# EAGLE design CanBus-Gartensteuerung (EAGLE 7.4.0)

## Sheet 1 of 3
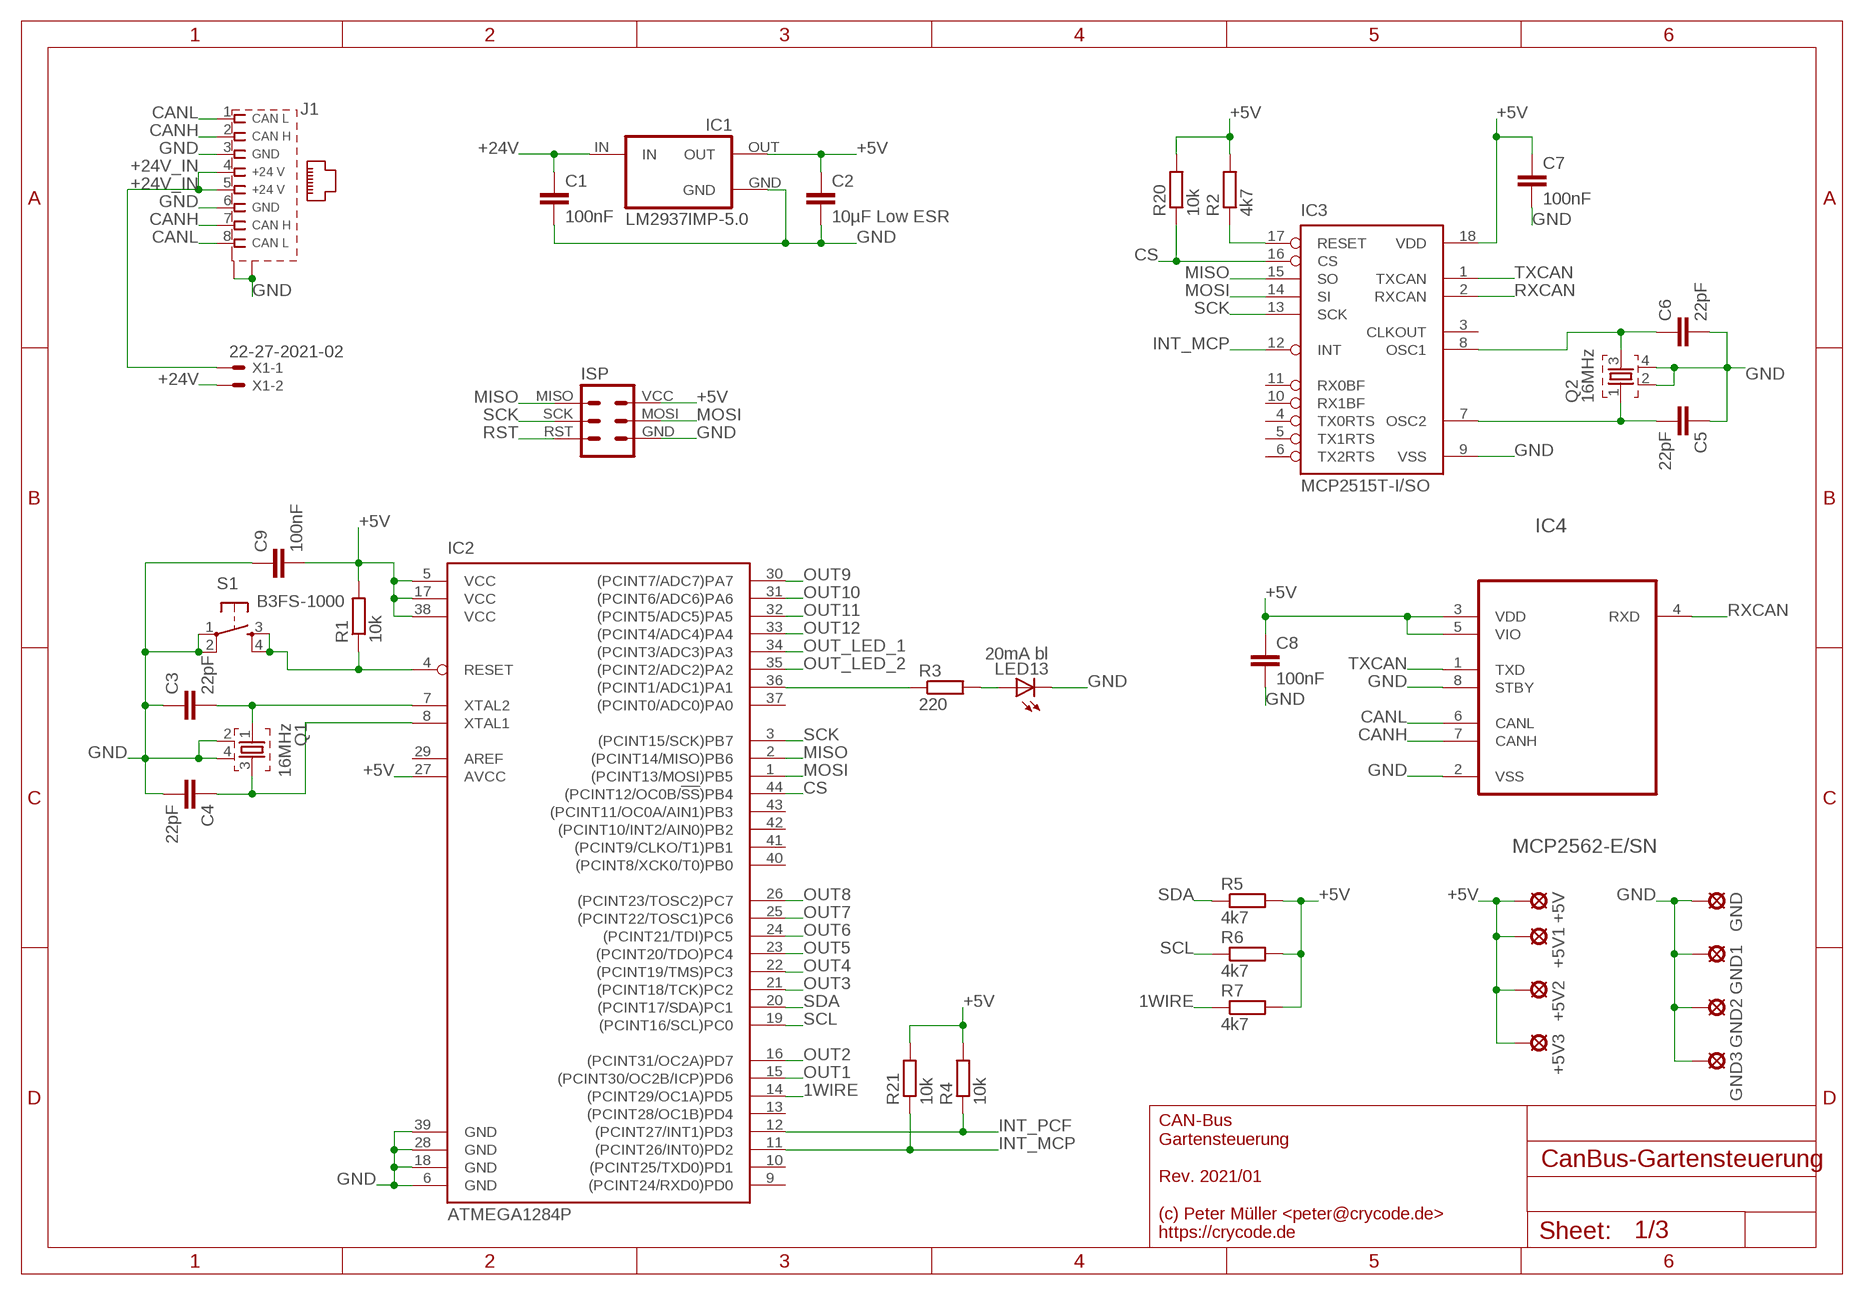
[diagram p0: schematic, sheet 1]

### Parts
+5V  LSP13  [LSP13]
+5V1  LSP13  [LSP13]
+5V2  LSP13  [LSP13]
+5V3  LSP13  [LSP13]
C1  100nF  C-EUC0805  [C0805]
C2  10µF Low ESR  C-EUC0805  [C0805]
C3  22pF  C-EUC0805  [C0805]
C4  22pF  C-EUC0805  [C0805]
C5  22pF  C-EUC0805  [C0805]
C6  22pF  C-EUC0805  [C0805]
C7  100nF  C-EUC0805  [C0805]
C8  100nF  C-EUC0805  [C0805]
C9  100nF  C-EUC0805  [C0805]
GND  LSP13  [LSP13]
GND1  LSP13  [LSP13]
GND2  LSP13  [LSP13]
GND3  LSP13  [LSP13]
IC1  LM2937IMP-5.0  [SOT223]
IC2  ATMEGA1284P  ATMEGA644A  [TQFP44]
IC3  MCP2515T-I/SO  [SO18L]
IC4  MCP2562-E/SN  [SO08]
ISP  ISPVIAS-ONLY-1.27MM  [ISP-VIAS-ONLY-1.27MM]
J1  RJ45-CAN  [MEBP_8-8G]
LED13  20mA bl  LEDCHIPLED_0805  [CHIPLED_0805]
Q1  16MHz  EUROQUARTZ-MMJ  [MJ-5X3.2]
Q2  16MHz  EUROQUARTZ-MMJ  [MJ-5X3.2]
R1  10k  R-EU_R0805  [R0805]
R2  4k7  R-EU_R0805  [R0805]
R3  220  R-EU_R0805  [R0805]
R4  10k  R-EU_R0805  [R0805]
R5  4k7  R-EU_R0805  [R0805]
R6  4k7  R-EU_R0805  [R0805]
R7  4k7  R-EU_R0805  [R0805]
R20  10k  R-EU_R0805  [R0805]
R21  10k  R-EU_R0805  [R0805]
S1  B3FS-1000  [B3FS-1000]
X1  22-27-2021-02  [6410-02]

### Nets
1WIRE: IC2.14((PCINT29/OC1A)PD5) R7.1 ; also sheet 2
+5V: +5V1.MP +5V2.MP +5V3.MP +5V.MP C2.1 C7.1 C8.1 C9.2 IC1.OUT IC2.5(VCC) IC2.17(VCC) IC2.27(AVCC) IC2.38(VCC) IC3.18(VDD) IC4.3(VDD) IC4.5(VIO) ISP.VCC R1.2 R2.2 R4.2 R5.2 R6.2 R7.2 R20.2 R21.2 ; also sheet 2
+24V: C1.1 IC1.IN X1.2 ; also sheet 3
+24V_IN: J1.4 J1.5 X1.1
CANH: IC4.7(CANH) J1.2 J1.7
CANL: IC4.6(CANL) J1.1 J1.8
CS: IC2.44((PCINT12/OC0B/!SS!)PB4) IC3.16(CS) R20.1
GND: C1.2 C2.2 C3.1 C4.2 C5.1 C6.2 C7.2 C8.2 C9.1 GND1.MP GND2.MP GND3.MP GND.MP IC1.GND IC2.6(GND) IC2.18(GND) IC2.28(GND) IC2.39(GND) IC3.9(VSS) IC4.2(VSS) IC4.8(STBY) ISP.GND J1.3 J1.6 J1.G1(S1) J1.G2(S2) LED13.C Q1.2 Q1.4 Q2.2 Q2.4 S1.1(P) S1.2(P1) ; also sheet 2,3
INT_MCP: IC2.11((PCINT26/INT0)PD2) IC3.12(INT) R21.1
INT_PCF: IC2.12((PCINT27/INT1)PD3) R4.1 ; also sheet 2
MISO: IC2.2((PCINT14/MISO)PB6) IC3.15(SO) ISP.MISO
MOSI: IC2.1((PCINT13/MOSI)PB5) IC3.14(SI) ISP.MOSI
N$1: IC3.17(RESET) R2.1
N$2: IC2.36((PCINT1/ADC1)PA1) R3.1
N$10: LED13.A R3.2
OUT1: IC2.15((PCINT30/OC2B/ICP)PD6) ; also sheet 2,3
OUT2: IC2.16((PCINT31/OC2A)PD7) ; also sheet 2,3
OUT3: IC2.21((PCINT18/TCK)PC2) ; also sheet 2,3
OUT4: IC2.22((PCINT19/TMS)PC3) ; also sheet 2,3
OUT5: IC2.23((PCINT20/TDO)PC4) ; also sheet 2,3
OUT6: IC2.24((PCINT21/TDI)PC5) ; also sheet 2,3
OUT7: IC2.25((PCINT22/TOSC1)PC6) ; also sheet 2,3
OUT8: IC2.26((PCINT23/TOSC2)PC7) ; also sheet 2,3
OUT9: IC2.30((PCINT7/ADC7)PA7) ; also sheet 2,3
OUT10: IC2.31((PCINT6/ADC6)PA6) ; also sheet 2,3
OUT11: IC2.32((PCINT5/ADC5)PA5) ; also sheet 2,3
OUT12: IC2.33((PCINT4/ADC4)PA4) ; also sheet 2,3
OUT_LED_1: IC2.34((PCINT3/ADC3)PA3) ; also sheet 3
OUT_LED_2: IC2.35((PCINT2/ADC2)PA2) ; also sheet 3
RST: IC2.4(RESET) ISP.RST R1.1 S1.3(S) S1.4(S1)
RXCAN: IC3.2(RXCAN) IC4.4(RXD)
SCK: IC2.3((PCINT15/SCK)PB7) IC3.13(SCK) ISP.SCK
SCL: IC2.19((PCINT16/SCL)PC0) R6.1 ; also sheet 2
SDA: IC2.20((PCINT17/SDA)PC1) R5.1 ; also sheet 2
TXCAN: IC3.1(TXCAN) IC4.1(TXD)
XTAL1: C3.2 IC2.7(XTAL2) Q1.1
XTAL2: C4.1 IC2.8(XTAL1) Q1.3
XTAL3: C5.2 IC3.7(OSC2) Q2.1
XTAL4: C6.1 IC3.8(OSC1) Q2.3
Unconnected: IC2.9((PCINT24/RXD0)PD0) IC2.10((PCINT25/TXD0)PD1) IC2.13((PCINT28/OC1B)PD4) IC2.29(AREF) IC2.37((PCINT0/ADC0)PA0) IC2.40((PCINT8/XCK0/T0)PB0) IC2.41((PCINT9/CLKO/T1)PB1) IC2.42((PCINT10/INT2/AIN0)PB2) IC2.43((PCINT11/OC0A/AIN1)PB3) IC3.3(CLKOUT) IC3.4(TX0RTS) IC3.5(TX1RTS) IC3.6(TX2RTS) IC3.10(RX1BF) IC3.11(RX0BF)

### Notes on the sheet
- CAN-Bus
  Gartensteuerung
  
  Rev. 2021/01
  
  (c) Peter Müller <peter@crycode.de>
  https://crycode.de

## Sheet 2 of 3
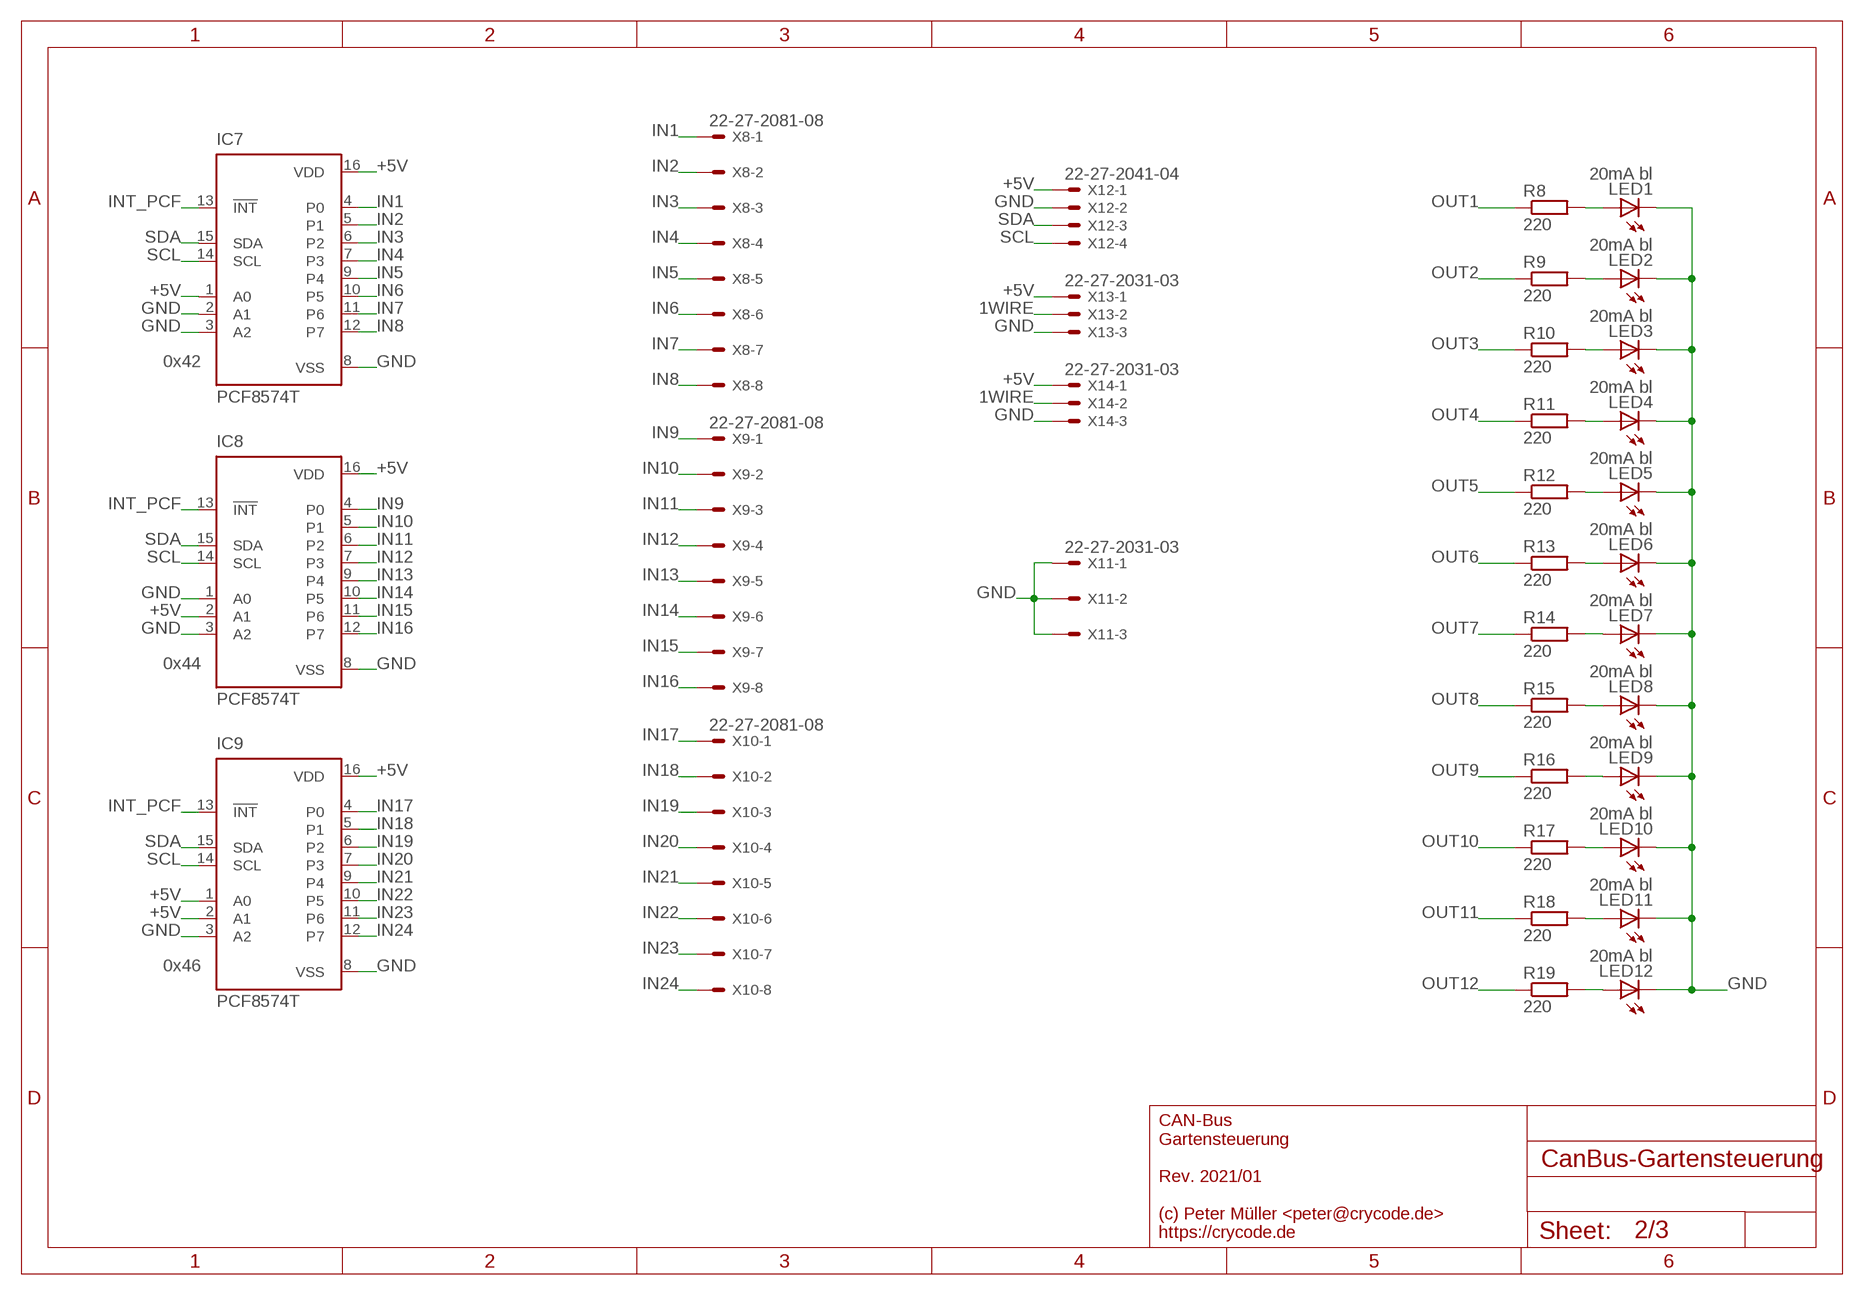
[diagram p1: schematic, sheet 2]

### Parts
IC7  PCF8574T  [SO16W]
IC8  PCF8574T  [SO16W]
IC9  PCF8574T  [SO16W]
LED1  20mA bl  LEDCHIPLED_0805  [CHIPLED_0805]
LED2  20mA bl  LEDCHIPLED_0805  [CHIPLED_0805]
LED3  20mA bl  LEDCHIPLED_0805  [CHIPLED_0805]
LED4  20mA bl  LEDCHIPLED_0805  [CHIPLED_0805]
LED5  20mA bl  LEDCHIPLED_0805  [CHIPLED_0805]
LED6  20mA bl  LEDCHIPLED_0805  [CHIPLED_0805]
LED7  20mA bl  LEDCHIPLED_0805  [CHIPLED_0805]
LED8  20mA bl  LEDCHIPLED_0805  [CHIPLED_0805]
LED9  20mA bl  LEDCHIPLED_0805  [CHIPLED_0805]
LED10  20mA bl  LEDCHIPLED_0805  [CHIPLED_0805]
LED11  20mA bl  LEDCHIPLED_0805  [CHIPLED_0805]
LED12  20mA bl  LEDCHIPLED_0805  [CHIPLED_0805]
R8  220  R-EU_R0805  [R0805]
R9  220  R-EU_R0805  [R0805]
R10  220  R-EU_R0805  [R0805]
R11  220  R-EU_R0805  [R0805]
R12  220  R-EU_R0805  [R0805]
R13  220  R-EU_R0805  [R0805]
R14  220  R-EU_R0805  [R0805]
R15  220  R-EU_R0805  [R0805]
R16  220  R-EU_R0805  [R0805]
R17  220  R-EU_R0805  [R0805]
R18  220  R-EU_R0805  [R0805]
R19  220  R-EU_R0805  [R0805]
X8  22-27-2081-08  [6410-08]
X9  22-27-2081-08  [6410-08]
X10  22-27-2081-08  [6410-08]
X11  22-27-2031-03  [6410-03]
X12  22-27-2041-04  [6410-04]
X13  22-27-2031-03  [6410-03]
X14  22-27-2031-03  [6410-03]

### Nets
1WIRE: X13.2 X14.2 ; also sheet 1
+5V: IC7.1(A0) IC7.16(VDD) IC8.2(A1) IC8.16(VDD) IC9.1(A0) IC9.2(A1) IC9.16(VDD) X12.1 X13.1 X14.1 ; also sheet 1
GND: IC7.2(A1) IC7.3(A2) IC7.8(VSS) IC8.1(A0) IC8.3(A2) IC8.8(VSS) IC9.3(A2) IC9.8(VSS) LED1.C LED2.C LED3.C LED4.C LED5.C LED6.C LED7.C LED8.C LED9.C LED10.C LED11.C LED12.C X11.1 X11.2 X11.3 X12.2 X13.3 X14.3 ; also sheet 1,3
IN1: IC7.4(P0) X8.1
IN2: IC7.5(P1) X8.2
IN3: IC7.6(P2) X8.3
IN4: IC7.7(P3) X8.4
IN5: IC7.9(P4) X8.5
IN6: IC7.10(P5) X8.6
IN7: IC7.11(P6) X8.7
IN8: IC7.12(P7) X8.8
IN9: IC8.4(P0) X9.1
IN10: IC8.5(P1) X9.2
IN11: IC8.6(P2) X9.3
IN12: IC8.7(P3) X9.4
IN13: IC8.9(P4) X9.5
IN14: IC8.10(P5) X9.6
IN15: IC8.11(P6) X9.7
IN16: IC8.12(P7) X9.8
IN17: IC9.4(P0) X10.1
IN18: IC9.5(P1) X10.2
IN19: IC9.6(P2) X10.3
IN20: IC9.7(P3) X10.4
IN21: IC9.9(P4) X10.5
IN22: IC9.10(P5) X10.6
IN23: IC9.11(P6) X10.7
IN24: IC9.12(P7) X10.8
INT_PCF: IC7.13(!INT) IC8.13(!INT) IC9.13(!INT) ; also sheet 1
N$22: LED1.A R8.2
N$23: LED2.A R9.2
N$24: LED3.A R10.2
N$25: LED4.A R11.2
N$32: LED5.A R12.2
N$33: LED6.A R13.2
N$34: LED7.A R14.2
N$35: LED8.A R15.2
N$36: LED9.A R16.2
N$37: LED10.A R17.2
N$38: LED12.A R19.2
N$39: LED11.A R18.2
OUT1: R8.1 ; also sheet 1,3
OUT2: R9.1 ; also sheet 1,3
OUT3: R10.1 ; also sheet 1,3
OUT4: R11.1 ; also sheet 1,3
OUT5: R12.1 ; also sheet 1,3
OUT6: R13.1 ; also sheet 1,3
OUT7: R14.1 ; also sheet 1,3
OUT8: R15.1 ; also sheet 1,3
OUT9: R16.1 ; also sheet 1,3
OUT10: R17.1 ; also sheet 1,3
OUT11: R18.1 ; also sheet 1,3
OUT12: R19.1 ; also sheet 1,3
SCL: IC7.14(SCL) IC8.14(SCL) IC9.14(SCL) X12.4 ; also sheet 1
SDA: IC7.15(SDA) IC8.15(SDA) IC9.15(SDA) X12.3 ; also sheet 1

### Notes on the sheet
- 0x42
- 0x44
- 0x46
- CAN-Bus
  Gartensteuerung
  
  Rev. 2021/01
  
  (c) Peter Müller <peter@crycode.de>
  https://crycode.de

## Sheet 3 of 3
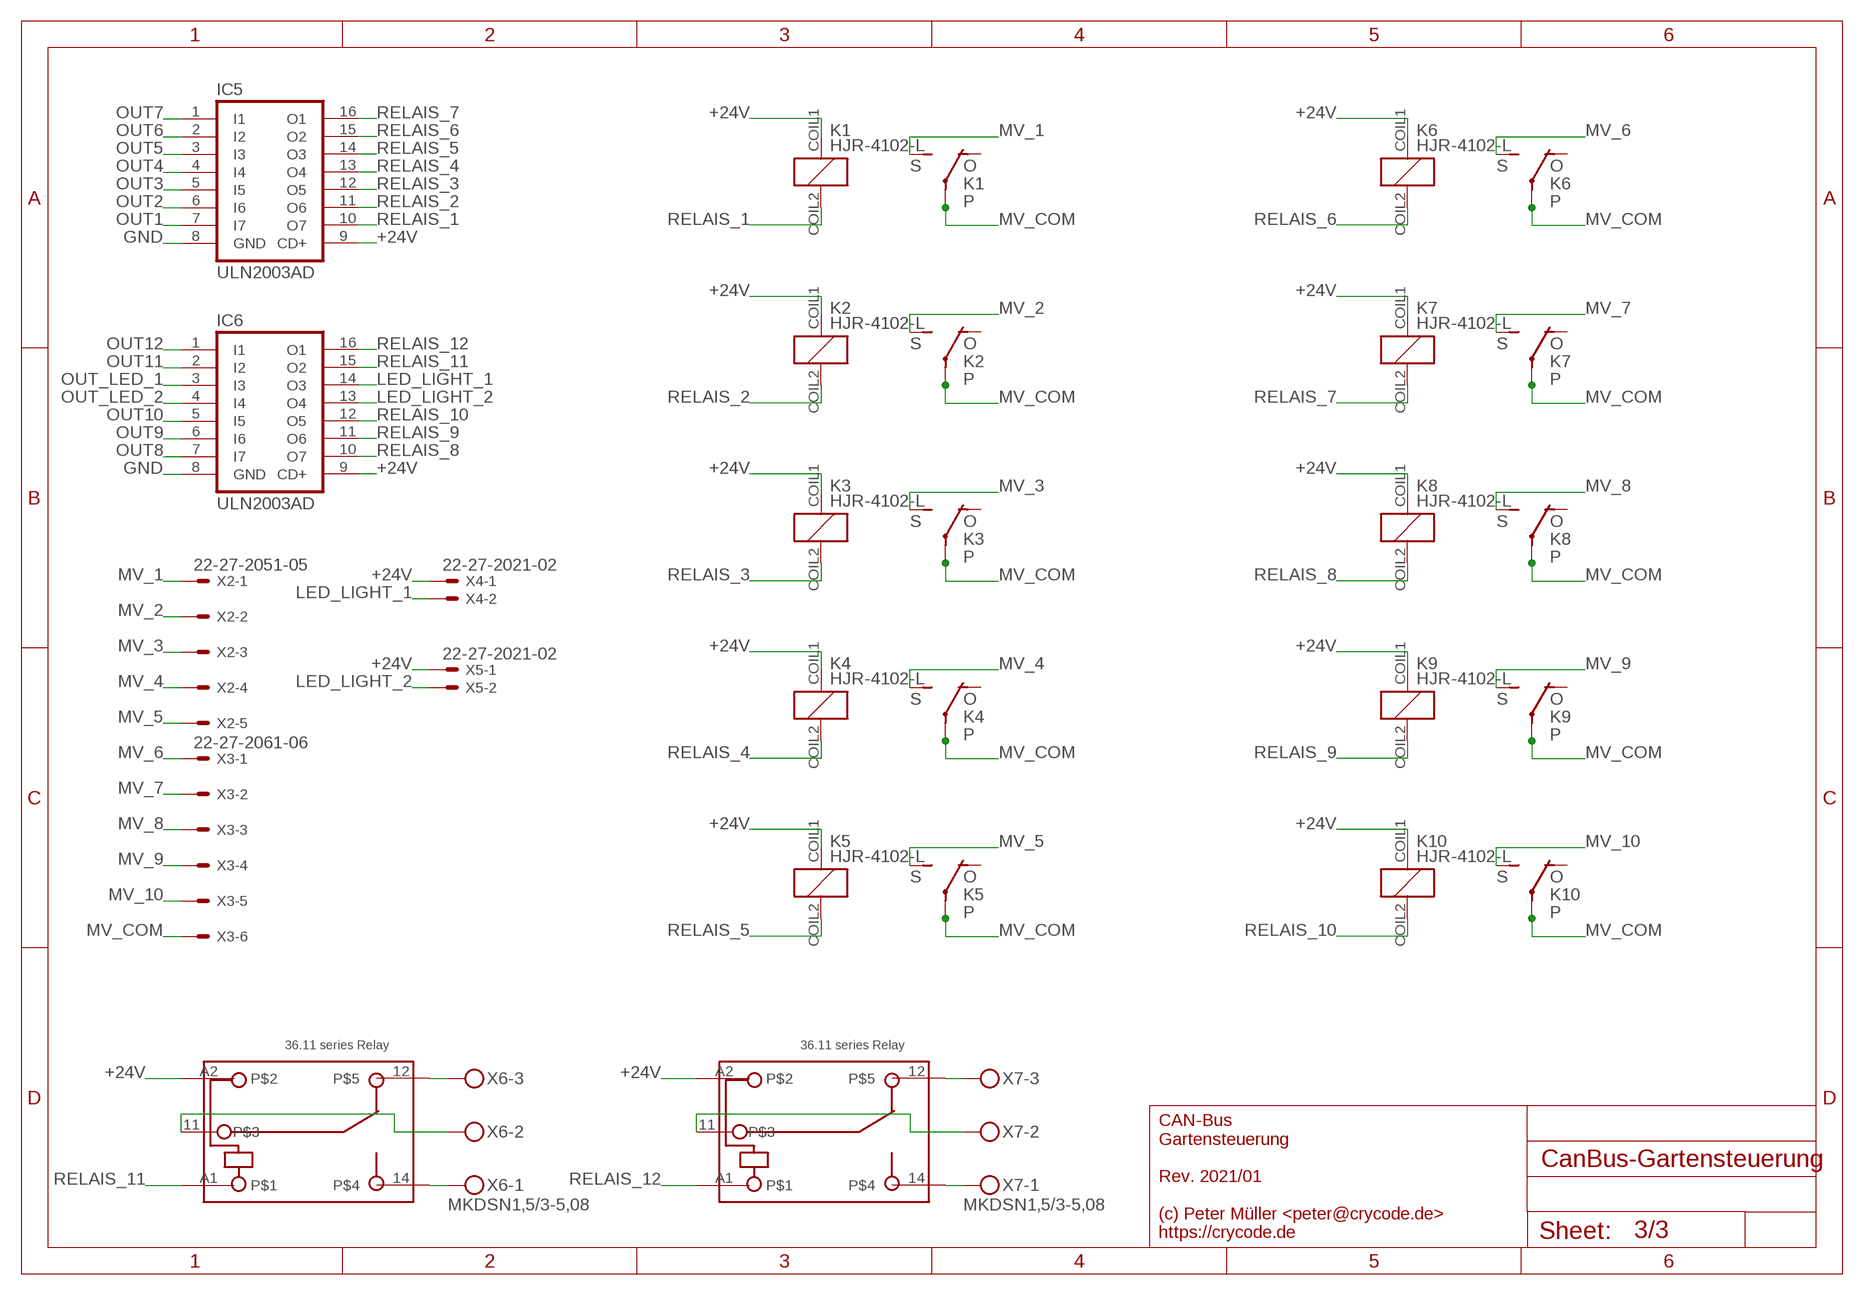
[diagram p2: schematic, sheet 3]

### Parts
IC5  ULN2003AD  [SO16]
IC6  ULN2003AD  [SO16]
K1  HJR-4102-L  [HJR4102]
K2  HJR-4102-L  [HJR4102]
K3  HJR-4102-L  [HJR4102]
K4  HJR-4102-L  [HJR4102]
K5  HJR-4102-L  [HJR4102]
K6  HJR-4102-L  [HJR4102]
K7  HJR-4102-L  [HJR4102]
K8  HJR-4102-L  [HJR4102]
K9  HJR-4102-L  [HJR4102]
K10  HJR-4102-L  [HJR4102]
K11  36.11  [36.11]
K12  36.11  [36.11]
X2  22-27-2051-05  [6410-05]
X3  22-27-2061-06  [6410-06]
X4  22-27-2021-02  [6410-02]
X5  22-27-2021-02  [6410-02]
X6  MKDSN1,5/3-5,08  [MKDSN1,5/3-5,08]
X7  MKDSN1,5/3-5,08  [MKDSN1,5/3-5,08]

### Nets
+24V: IC5.9(CD+) IC6.9(CD+) K1.COIL1 K2.COIL1 K3.COIL1 K4.COIL1 K5.COIL1 K6.COIL1 K7.COIL1 K8.COIL1 K9.COIL1 K10.COIL1 K11.A2 K12.A2 X4.1 X5.1 ; also sheet 1
GND: IC5.8(GND) IC6.8(GND) ; also sheet 1,2
LED_LIGHT_1: IC6.14(O3) X4.2
LED_LIGHT_2: IC6.13(O4) X5.2
MV_1: K1.CON1DEFAULT(S) X2.1
MV_2: K2.CON1DEFAULT(S) X2.2
MV_3: K3.CON1DEFAULT(S) X2.3
MV_4: K4.CON1DEFAULT(S) X2.4
MV_5: K5.CON1DEFAULT(S) X2.5
MV_6: K6.CON1DEFAULT(S) X3.1
MV_7: K7.CON1DEFAULT(S) X3.2
MV_8: K8.CON1DEFAULT(S) X3.3
MV_9: K9.CON1DEFAULT(S) X3.4
MV_10: K10.CON1DEFAULT(S) X3.5
MV_COM: K1.CENTER1(P) K1.CENTER2(P2) K2.CENTER1(P) K2.CENTER2(P2) K3.CENTER1(P) K3.CENTER2(P2) K4.CENTER1(P) K4.CENTER2(P2) K5.CENTER1(P) K5.CENTER2(P2) K6.CENTER1(P) K6.CENTER2(P2) K7.CENTER1(P) K7.CENTER2(P2) K8.CENTER1(P) K8.CENTER2(P2) K9.CENTER1(P) K9.CENTER2(P2) K10.CENTER1(P) K10.CENTER2(P2) X3.6
N$11: K11.12 X6.3
N$12: K11.14 X6.1
N$13: K12.12 X7.3
N$14: K12.14 X7.1
N$17: K11.11 X6.2
N$18: K12.11 X7.2
OUT1: IC5.7(I7) ; also sheet 1,2
OUT2: IC5.6(I6) ; also sheet 1,2
OUT3: IC5.5(I5) ; also sheet 1,2
OUT4: IC5.4(I4) ; also sheet 1,2
OUT5: IC5.3(I3) ; also sheet 1,2
OUT6: IC5.2(I2) ; also sheet 1,2
OUT7: IC5.1(I1) ; also sheet 1,2
OUT8: IC6.7(I7) ; also sheet 1,2
OUT9: IC6.6(I6) ; also sheet 1,2
OUT10: IC6.5(I5) ; also sheet 1,2
OUT11: IC6.2(I2) ; also sheet 1,2
OUT12: IC6.1(I1) ; also sheet 1,2
OUT_LED_1: IC6.3(I3) ; also sheet 1
OUT_LED_2: IC6.4(I4) ; also sheet 1
RELAIS_1: IC5.10(O7) K1.COIL2
RELAIS_2: IC5.11(O6) K2.COIL2
RELAIS_3: IC5.12(O5) K3.COIL2
RELAIS_4: IC5.13(O4) K4.COIL2
RELAIS_5: IC5.14(O3) K5.COIL2
RELAIS_6: IC5.15(O2) K6.COIL2
RELAIS_7: IC5.16(O1) K7.COIL2
RELAIS_8: IC6.10(O7) K8.COIL2
RELAIS_9: IC6.11(O6) K9.COIL2
RELAIS_10: IC6.12(O5) K10.COIL2
RELAIS_11: IC6.15(O2) K11.A1
RELAIS_12: IC6.16(O1) K12.A1
Unconnected: K1.CON2OPTION(O) K2.CON2OPTION(O) K3.CON2OPTION(O) K4.CON2OPTION(O) K5.CON2OPTION(O) K6.CON2OPTION(O) K7.CON2OPTION(O) K8.CON2OPTION(O) K9.CON2OPTION(O) K10.CON2OPTION(O)

### Notes on the sheet
- CAN-Bus
  Gartensteuerung
  
  Rev. 2021/01
  
  (c) Peter Müller <peter@crycode.de>
  https://crycode.de

## Power pins joined to a net without a drawn wire
GND: IC1.GND@(GND)

## Library data of the parts
+5V +5V1-+5V3 GND GND1-GND3 = solpad:LSP13: SOLDER PAD drill 1.3 mm, distributor Buerklin, 12H562
C1-C9 = rcl:C-EU: CAPACITOR, European symbol
IC1 = lm2937:LM2937IMP-*: 400 and 500 mA Low Dropout Voltage Regulator NATIONAL SEMICONDUCTOR created by Peter.Hofmann@ph-tronic.de <mailto:Reter.Hofmann@ph-tronic.de> 10-2004 Rev.0
IC2 = atmel:ATMEGA644: 8-bit Microcontroller with 64K Bytes In-System Programmable Flash Source: http://www.atmel.com/dyn/resources/prod_documents/doc2593.pdf; MPN: ATMEGA644PV-10AU; OC_FARNELL: 1455123; OC_NEWARK: 58M3748
IC3 = mcp2515_2551_2562:MCP2515
IC4 = mcp2515_2551_2562:MCP2562: High-Speed CAN Transceiver,DIP-8
IC5 IC6 = uln-udn:ULN2003A: DRIVER ARRAY
IC7-IC9 = micro-philips:PCF8574: I2C-Bus Remote 8-bit I/O expander http://www.semiconductors.philips.com/acrobat_download/datasheets/PCF8574_4.pdf; MPN: PCF8574T/3,512; OC_FARNELL: 1201255; OC_NEWARK: 70R6870
ISP = pogo-isp:ISP: ISP connector pads for Pogo ISP There are variants for mixed pads/vias, pads only and vias.
J1 = can-bus:RJ45-CAN: RJ45 CAN-Bus Reichelt Bestell-Nr.: MEBP 8-8G
K1-K10 = relay:HJR-4102-L
K11 K12 = relay_finder_36_11:36.11: Printed circuit mount miniature 10 A relay one pole changeover contacts Conform RoHS
LED1-LED13 = led:LED: LED OSRAM: - CHIPLED LG R971, LG N971, LY N971, LG Q971, LY Q971, LO R971, LY R971 LH N974, LH R974 LS Q976, LO Q976, LY Q976 LO Q996 - Hyper CHIPLED LW Q18S LB Q993, LB Q99A, LB R99A - SideLED LS A670, LO A670, LY A670, LG A670, LP A670 LB A673, LV A673, LT A673, LW A673 LH A674 LY A675 LS A676, LA A676, LO A676, LY A676, LW A676 LS A679, LY A679, LG A679 - Hyper Micro SIDELED® LS Y876, LA Y876, LO Y876, LY Y876 LT Y87S - SmartLED LW L88C, LW L88S LB L89C, LB L89S, LG L890 LS L89K, LO L89K, LY L89K LS L896, LA L896, LO L896, LY L896 - TOPLED LS T670, LO T670, LY T670, LG T670, LP T670 LSG T670, LSP T670, LSY T670, LOP T670, LYG T670 LG T671, LOG T671, LSG T671 LB T673, LV T673, LT T673, LW T673 LH T674 LS T676, LA T676, LO T676, LY T676, LB T676, LH T676, LSB T676, LW T676 LB T67C, LV T67C, LT T67C, LS T67K, LO T67K, LY T67K, LW E67C LS E67B, LA E67B, LO E67B, LY E67B, LB E67C, LV E67C, LT E67C LW T67C LS T679, LY T679, LG T679 LS T770, LO T770, LY T770, LG T770, LP T770 LB T773, LV T773, LT T773, LW T773 LH T774 LS E675, LA E675, LY E675, LS T675 LS T776, LA T776, LO T776, LY T776, LB T776 LHGB T686 LT T68C, LB T68C - Hyper Mini TOPLED® LB M676 - Mini TOPLED Santana® LG M470 LS M47K, LO M47K, LY M47K Source: http://www.osram.convergy.de LUXEON: - LUMILED® LXK2-PW12-R00, LXK2-PW12-S00, LXK2-PW14-U00, LXK2-PW14-V00 LXK2-PM12-R00, LXK2-PM12-S00, LXK2-PM14-U00 LXK2-PE12-Q00, LXK2-PE12-R00, LXK2-PE12-S00, LXK2-PE14-T00, LXK2-PE14-U00 LXK2-PB12-K00, LXK2-PB12-L00, LXK2-PB12-M00, LXK2-PB14-N00, LXK2-PB14-P00, LXK2-PB14-Q00 LXK2-PR12-L00, LXK2-PR12-M00, LXK2-PR14-Q00, LXK2-PR14-R00 LXK2-PD12-Q00, LXK2-PD12-R00, LXK2-PD12-S00 LXK2-PH12-R00, LXK2-PH12-S00 LXK2-PL12-P00, LXK2-PL12-Q00, LXK2-PL12-R00 Source: www.luxeon.com KINGBRIGHT: KA-3528ASYC Source: www.kingbright.com
Q1 Q2 = crystal-smd:EUROQUARTZ-M*: Keramik-SMD-Quarz, 5x7x1,2mm EUROQUARTZ MQ2 Crystal, 4 pad Soruce: MQ <https://cdn-reichelt.de/documents/datenblatt/B400/MQ.pdf>, MJ <https://cdn-reichelt.de/documents/datenblatt/B400/MJ.pdf>; REICHELT: 16,000000-MJ
R1-R21 = rcl:R-EU_: RESISTOR, European symbol
S1 = b3fs-1000:B3FS-1000
X1 X4 X5 = con-molex:22-?-02: CONNECTOR wire to board 2.54 mm (.1 inch) pitch header; OC_FARNELL: unknown; OC_NEWARK: unknown
X2 = con-molex:22-?-05: CONNECTOR wire to board 2.54 mm (.1 inch) pitch header; OC_FARNELL: unknown; OC_NEWARK: unknown
X3 = con-molex:22-?-06: CONNECTOR wire to board 2.54 mm (.1 inch) pitch header; OC_FARNELL: unknown; OC_NEWARK: unknown
X6 X7 = con-phoenix-508:MKDSN1,5/3-5,08: MKDSN 1,5/ 3-5,08 Printklemme Nennstrom: 13,5 A Nennspannung: 250 V Rastermaß: 5,08 mm Polzahl: 3 Anschlussart: Schraubanschluss Montage: Löten Anschlussrichtung Leiter/Platine: 0 ° Artikelnummer: 1729131 Source: http://eshop.phoenixcontact.com .. 1729131.pdf
X8-X10 = con-molex:22-?-08: CONNECTOR wire to board 2.54 mm (.1 inch) pitch header; OC_FARNELL: unknown; OC_NEWARK: unknown
X11 X13 X14 = con-molex:22-?-03: CONNECTOR wire to board 2.54 mm (.1 inch) pitch header; OC_FARNELL: unknown; OC_NEWARK: unknown
X12 = con-molex:22-?-04: CONNECTOR wire to board 2.54 mm (.1 inch) pitch header; OC_FARNELL: unknown; OC_NEWARK: unknown

## Net classes
1 230V: width 2.54 mm, clearance 2.54 mm

## Board
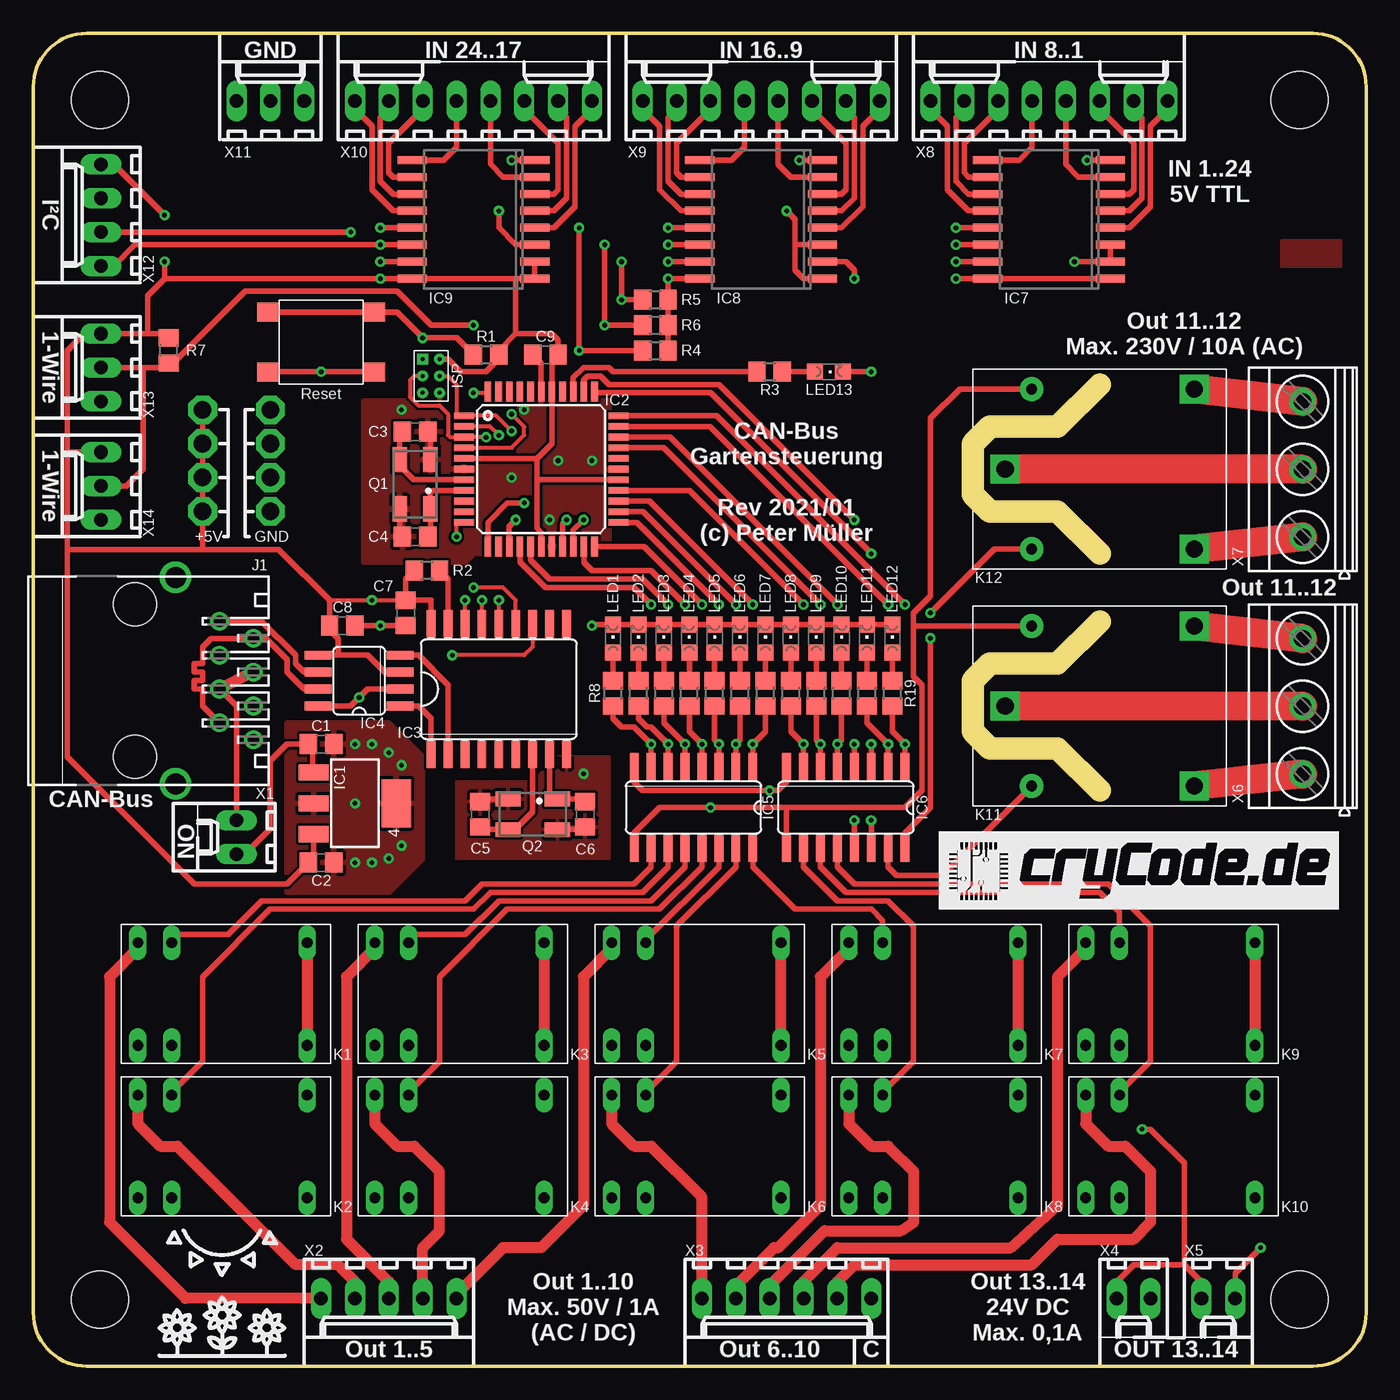
[diagram p3: board, top side]
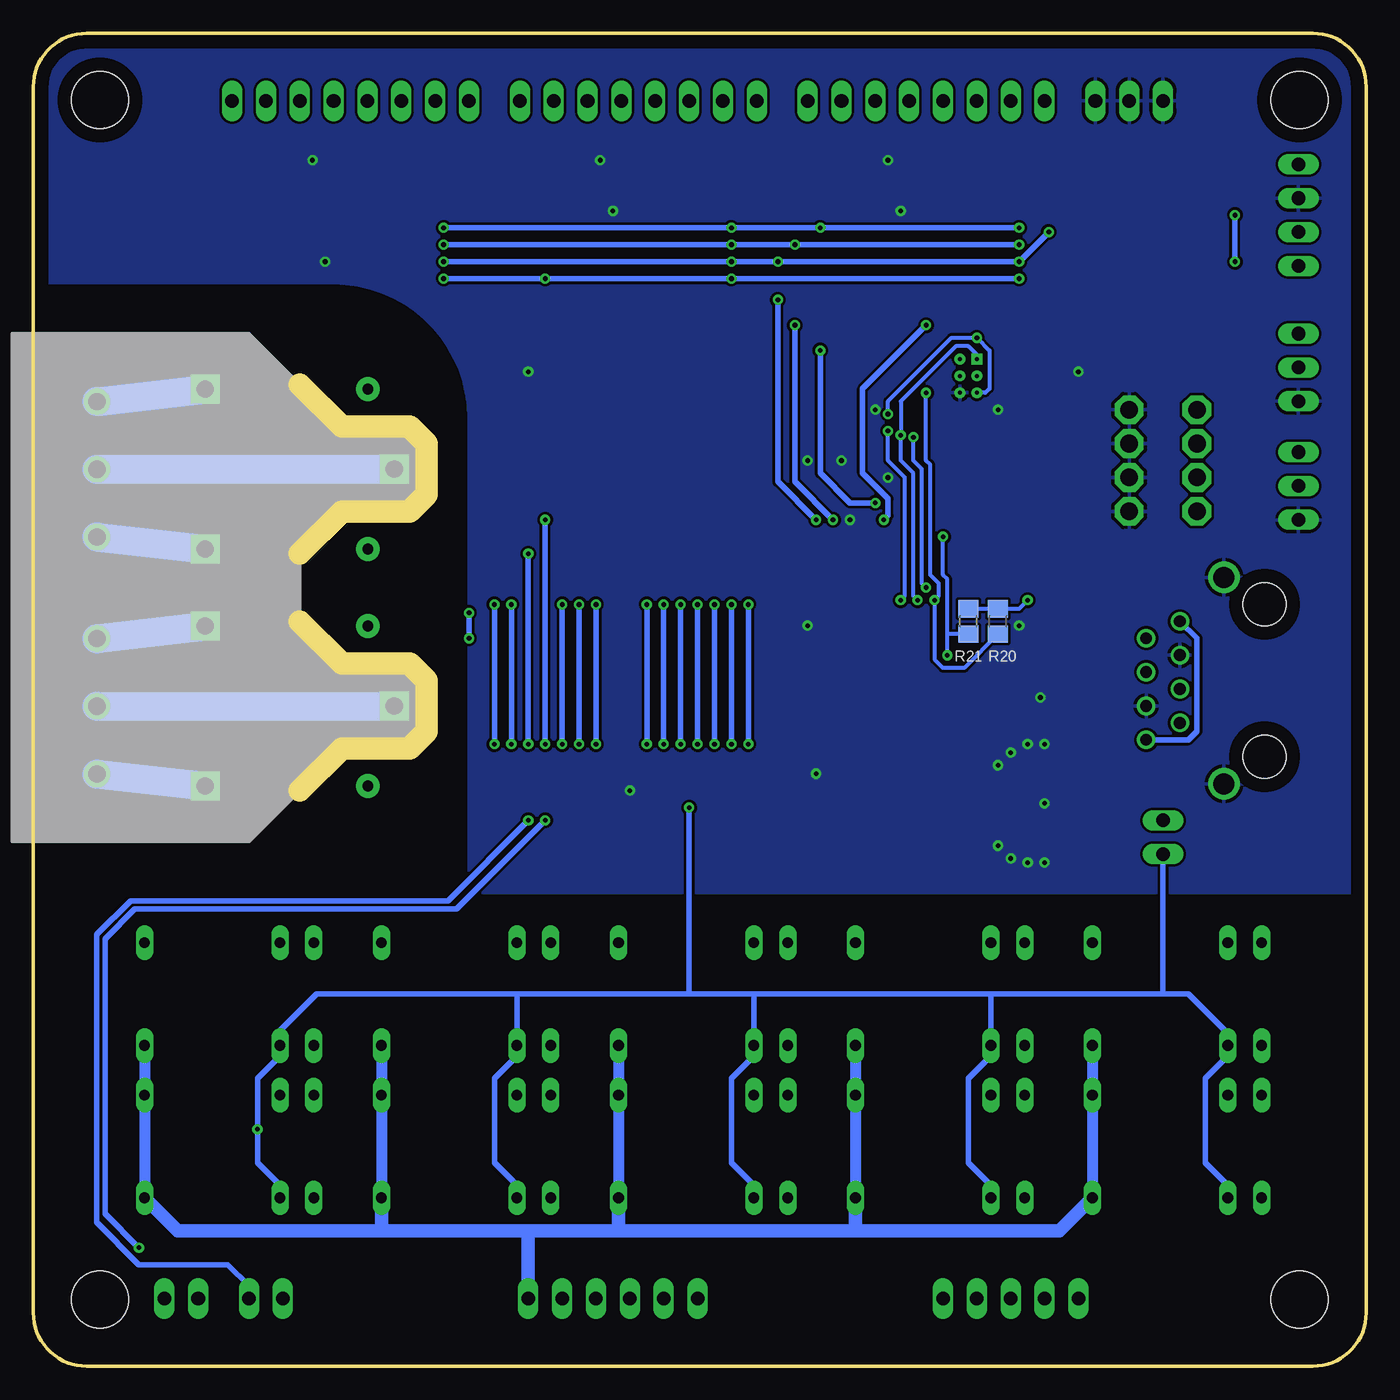
[diagram p4: board, bottom side, seen from below]

Size 100 x 100 mm. Coordinates in mm from the lower left corner, seen from the top.
Outline: 4,0 96,0 arc90 100,4 100,96 arc90 96,100 4,100 arc90 0,96 0,4 arc90 4,0
Copper layers (1*16): Top 0.035mm / dielectric 1.5mm / Bottom 0.035mm
Design rules "allpcb2 *": minimum track width 8mil, minimum drill 0.3mm, track to track 8mil, track to pad 8mil, pad to pad 8mil, via to via 8mil, smd to smd 6mil, copper to edge 40mil, drill to drill 8mil, minimum pad ring 10mil, minimum via ring 8mil, stop-mask expansion 0.1mm, vias tented up to drill 0.5mm, thermal gap 10mil
Holes 4.3 mm at 5,5 95,5 95,95 5,95
Milling: 14 lines

### Footprints (pad centres in the part's own frame; a part is rotated, then mirrored left to right if it is on the bottom)
LSP13 = drill 1.321 pad 2.159 octagon: MP 0,0
C0805 = smd 1.3 x 1.5: 1 -0.95,0; 2 0.95,0
SOT223 = smd 1.219 x 2.235: GND 0,-3.099; IN -2.311,-3.099; OUT 2.311,-3.099 | smd 3.6 x 2.2: GND@ 0,3.099
TQFP44 = smd 1.5 x 0.5: 1 -5.8,4; 2 -5.8,3.2; 3 -5.8,2.4; 4 -5.8,1.6; 5 -5.8,0.8; 6 -5.8,0; 7 -5.8,-0.8; 8 -5.8,-1.6; 9 -5.8,-2.4; 10 -5.8,-3.2; 11 -5.8,-4; 23 5.8,-4; 24 5.8,-3.2; 25 5.8,-2.4; 26 5.8,-1.6; 27 5.8,-0.8; 28 5.8,0; 29 5.8,0.8; 30 5.8,1.6; 31 5.8,2.4; 32 5.8,3.2; 33 5.8,4 | smd 0.5 x 1.5: 12 -4,-5.8; 13 -3.2,-5.8; 14 -2.4,-5.8; 15 -1.6,-5.8; 16 -0.8,-5.8; 17 0,-5.8; 18 0.8,-5.8; 19 1.6,-5.8; 20 2.4,-5.8; 21 3.2,-5.8; 22 4,-5.8; 34 4,5.8; 35 3.2,5.8; 36 2.4,5.8; 37 1.6,5.8; 38 0.8,5.8; 39 0,5.8; 40 -0.8,5.8; 41 -1.6,5.8; 42 -2.4,5.8; 43 -3.2,5.8; 44 -4,5.8
SO18L = smd 0.66 x 2.032: 1 -5.08,-4.902; 2 -3.81,-4.902; 3 -2.54,-4.902; 4 -1.27,-4.902; 5 0,-4.902; 6 1.27,-4.902; 7 2.54,-4.902; 8 3.81,-4.902; 9 5.08,-4.902; 10 5.08,4.902; 11 3.81,4.902; 12 2.54,4.902; 13 1.27,4.902; 14 0,4.902; 15 -1.27,4.902; 16 -2.54,4.902; 17 -3.81,4.902; 18 -5.08,4.902
SO08 = smd 0.66 x 2.032: 1 -1.905,-3.073; 2 -0.635,-3.073; 3 0.635,-3.073; 4 1.905,-3.073; 5 1.905,3.073; 6 0.635,3.073; 7 -0.635,3.073; 8 -1.905,3.073
SO16 = smd 0.66 x 2.032: 1 -4.445,-3.073; 2 -3.175,-3.073; 3 -1.905,-3.073; 4 -0.635,-3.073; 5 0.635,-3.073; 6 1.905,-3.073; 7 3.175,-3.073; 8 4.445,-3.073; 9 4.445,3.073; 10 3.175,3.073; 11 1.905,3.073; 12 0.635,3.073; 13 -0.635,3.073; 14 -1.905,3.073; 15 -3.175,3.073; 16 -4.445,3.073
SO16W = smd 0.6 x 2.2: 1 -4.445,-4.6; 2 -3.175,-4.6; 3 -1.905,-4.6; 4 -0.635,-4.6; 5 0.635,-4.6; 6 1.905,-4.6; 7 3.175,-4.6; 8 4.445,-4.6; 9 4.445,4.6; 10 3.175,4.6; 11 1.905,4.6; 12 0.635,4.6; 13 -0.635,4.6; 14 -1.905,4.6; 15 -3.175,4.6; 16 -4.445,4.6
ISP-VIAS-ONLY-1.27MM = drill 0.3 pad 0.762: GND 0.635,-1.27; MOSI 0.635,0; RST -0.635,-1.27; SCK -0.635,0; VCC 0.635,1.27 | drill 0.3 pad 0.762 square: MISO -0.635,1.27
MEBP_8-8G = drill 0.889: 1 -4.445,6.35; 2 -3.175,8.89; 3 -1.905,6.35; 4 -0.635,8.89; 5 0.635,6.35; 6 1.905,8.89; 7 3.175,6.35; 8 4.445,8.89 | drill 1.575 pad 2.184: G1 -7.745,3.05; G2 7.745,3.05 | hole 3.251: -5.715,0; 5.715,0
HJR4102 = drill 0.8 long: CENTER1 -5.933,3.877; CENTER2 -5.933,-3.839; COIL1 4.227,3.877; COIL2 4.227,-3.839; CON1DEFAULT 6.767,-3.839; CON2OPTION 6.767,3.877
36.11 = drill 1.3 pad 2.184 square: 11 -7.1,0; 12 7.1,6; 14 7.1,-6 | drill 0.8 pad 1.778: A1 -5.1,-6; A2 -5.1,6
CHIPLED_0805 = smd 1.2 x 1.2: A 0,-1.05; C 0,1.05
MJ-5X3.2 = smd 1.9 x 1.1: 1 -1.85,-1.15; 2 1.85,-1.15; 3 1.85,1.15; 4 -1.85,1.15
R0805 = smd 1.3 x 1.5: 1 -0.95,0; 2 0.95,0
B3FS-1000 = smd 1.6 x 1.4: 1 4,-2.25; 2 -4,-2.25; 3 4,2.25; 4 -4,2.25
6410-02 = drill 1.016 long: 1 1.27,0; 2 -1.27,0
6410-05 = drill 1.016 long: 1 5.08,0; 2 2.54,0; 3 0,0; 4 -2.54,0; 5 -5.08,0
6410-06 = drill 1.016 long: 1 6.35,0; 2 3.81,0; 3 1.27,0; 4 -1.27,0; 5 -3.81,0; 6 -6.35,0
MKDSN1,5/3-5,08 = drill 1.3 pad 2: 1 -7.641,0.025; 2 -2.561,0.025; 3 2.519,0.025
6410-08 = drill 1.016 long: 1 8.89,0; 2 6.35,0; 3 3.81,0; 4 1.27,0; 5 -1.27,0; 6 -3.81,0; 7 -6.35,0; 8 -8.89,0
6410-03 = drill 1.016 long: 1 2.54,0; 2 0,0; 3 -2.54,0
6410-04 = drill 1.016 long: 1 3.81,0; 2 1.27,0; 3 -1.27,0; 4 -3.81,0

### Placement (x,y rotation side)
+5V  12.7,71.75 180 top
+5V1  12.7,69.22 180 top
+5V2  12.7,66.67 180 top
+5V3  12.7,64.14 180 top
C1  21.59,46.67 0 top
C2  21.59,37.78 0 top
C3  28.64,70.1 180 top
C4  28.64,62.23 180 top
C5  33.53,41.4 270 top
C6  41.4,41.4 270 top
C7  27.94,56.52 270 top
C8  23.18,55.56 0 top
C9  38.42,75.88 0 top
GND  17.78,71.75 0 top
GND1  17.78,69.22 0 top
GND2  17.78,66.67 0 top
GND3  17.78,64.14 0 top
IC1  24.13,42.23 270 top
IC2  38.1,67.31 0 top
IC3  34.92,50.8 0 top
IC4  24.45,51.44 90 top
IC5  49.53,41.91 180 top
IC6  60.96,41.91 180 top
IC7  76.2,86.04 90 top
IC8  54.61,86.04 90 top
IC9  33.02,86.04 90 top
ISP  29.84,74.3 0 top
J1  7.62,51.44 270 top
K1  14.61,27.94 180 top
K2  14.61,16.51 180 top
K3  32.38,27.94 180 top
K4  32.38,16.51 180 top
K5  50.16,27.94 180 top
K6  50.16,16.51 180 top
K7  67.94,27.94 180 top
K8  67.94,16.51 180 top
K9  85.72,27.94 180 top
K10  85.72,16.51 180 top
K11  80.01,49.53 0 top
K12  80.01,67.31 0 top
LED1  43.5,54.61 0 top
LED2  45.4,54.61 0 top
LED3  47.31,54.61 0 top
LED4  49.21,54.61 0 top
LED5  51.12,54.61 0 top
LED6  53.02,54.61 0 top
LED7  54.93,54.61 0 top
LED8  56.83,54.61 0 top
LED9  58.74,54.61 0 top
LED10  60.64,54.61 0 top
LED11  62.55,54.61 0 top
LED12  64.45,54.61 0 top
LED13  59.69,74.61 270 top
Q1  28.64,66.17 270 top
Q2  37.47,41.4 0 top
R1  33.97,75.88 0 top
R2  29.53,59.69 180 top
R3  55.24,74.61 0 top
R4  46.67,76.2 0 top
R5  46.67,80.01 0 top
R6  46.67,78.11 0 top
R7  10.16,76.2 90 top
R8  43.5,50.48 90 top
R9  45.4,50.48 90 top
R10  47.31,50.48 90 top
R11  49.21,50.48 90 top
R12  51.12,50.48 90 top
R13  53.02,50.48 90 top
R14  54.93,50.48 90 top
R15  56.83,50.48 90 top
R16  58.74,50.48 90 top
R17  60.64,50.48 90 top
R18  62.55,50.48 90 top
R19  64.45,50.48 90 top
R20  27.62,55.88 90 bottom
R21  29.84,55.88 90 bottom
S1  21.59,76.83 0 top
U$2  [30MM]  67.94,34.29 0 top
X1  15.24,39.69 90 top
X2  26.67,5.08 180 top
X3  56.52,5.08 180 top
X4  82.55,5.08 180 top
X5  88.9,5.08 180 top
X6  95.25,52.07 90 top
X7  95.25,69.85 90 top
X8  76.2,94.93 0 top
X9  54.61,94.93 0 top
X10  33.02,94.93 0 top
X11  17.78,94.93 0 top
X12  5.08,86.36 90 top
X13  5.08,74.93 90 top
X14  5.08,66.04 90 top

### Tracks (layer width: path | path; a pad name or v marks a point on that pad's centre or on a via)
1WIRE  (via drill 0.35 pad 0.7)
  Top 0.406: IC2.14 35.7,63.01 v36.2,63.5 | X13.2 8.26,74.93 | 8.26,74.93 8.26,67.31 6.99,66.04 X14.2 | 8.26,74.93 10.16,74.93 R7.1 | R7.1 | v33.02,78.11 29.84,78.11 27.3,80.64 15.88,80.64 10.48,75.25 R7.1
  Bottom 0.406: v36.2,63.5 35.88,63.82 35.88,65.09 37.78,66.99 37.78,73.34 v33.02,78.11
+5V  (via drill 0.35 pad 0.7)
  Top 0.305: 22.23,57.47 v25.4,57.47 C7.1
  Top 0.406: 29.84,56.2 IC3.18 29.84,57.47 C7.1 27.94,59.05 R2.2 | IC4.3 26.35,52.07 25.08,53.34 22.86,53.34 | IC4.5 22.86,53.34 | IC2.5 37.78,68.11 | 37.78,68.11 37.78,66.51 | 37.78,66.51 37.78,62.87 38.1,62.55 IC2.17 | +5V.MP +5V1.MP +5V2.MP +5V3.MP 12.7,61.27 | C9.2 38.9,75.42 IC2.38 38.9,69.23 37.78,68.11 | 36.2,77.47 34.92,76.2 R1.2 34.61,75.89 34.61,75.25 33.97,74.61 32.07,74.61 31.11,75.56 ISP.VCC | C9.2 | IC9.2 IC9.1 36.2,81.6 | IC7.1 IC7.16 v69.22,81.6 | v26.04,81.6 IC9.16 36.2,81.6 | IC8.16 v47.62,81.6 R5.2 R6.2 R4.2 | IC8.2 60.96,82.87 61.59,82.23 v61.59,81.6 | v26.03,81.59 v26.04,81.6 | C9.2 39.37,76.99 38.89,77.47 36.2,77.47 | 12.7,61.27 18.42,61.27 22.23,57.47 C8.1 22.23,55.24 22.86,54.61 22.86,53.34 | 12.7,61.27 2.54,61.27 | 2.54,68.58 2.54,76.2 3.81,77.47 X13.1 8.57,77.47 | 2.54,68.58 2.54,61.27 | 2.54,61.27 2.54,45.72 12.06,36.2 19.05,36.2 C2.1 21.03,38.17 IC1.OUT | X14.1 2.54,68.58 | 36.2,77.47 36.2,81.6 | 8.57,77.47 9.84,77.47 R7.2 | v9.84,86.36 6.03,90.17 X12.1 | 8.57,77.47 8.57,80.33 9.84,81.6 | 9.84,81.6 v26.04,81.6 | v9.84,82.87 9.84,81.6 | 37.78,66.51 IC2.27
  Bottom 0.305: R21.2 R20.2 26.04,56.83 v25.4,57.47
  Bottom 0.406: v69.22,81.6 v61.59,81.6 v47.62,81.6 v26.04,81.6 | v9.84,82.87 v9.84,86.36
+24V  (via drill 0.35 pad 0.7)
  Top 0.406: IC1.IN 20.82,44.74 20.95,44.87 20.95,46.36 C1.1 19.05,46.67 17.78,45.4 17.78,40.32 15.88,38.42 X1.2 | 56.52,41.91 IC6.9 | 56.52,41.91 v50.8,41.91 46.99,41.91 45.09,40.01 IC5.9 | 56.52,41.91 65.41,41.91 66.67,43.18 66.67,51.12 66.04,51.75 66.04,55.53 | K12.A2 69.5,73.31 67.31,71.12 67.31,57.78 66.04,56.52 66.04,55.53 | K11.A2 66.04,55.53 | 86.36,7.62 86.36,15.24 83.82,17.78 v83.19,17.78 | 86.36,7.62 87.63,6.35 X5.1 | 86.36,7.62 82.55,7.62 81.28,6.35 X4.1
  Bottom 0.406: K4.COIL1 28.16,13.55 29.84,15.24 29.84,21.59 28.16,23.28 K3.COIL1 28.16,27.94 | K6.COIL1 45.94,13.55 47.62,15.24 47.62,21.59 45.94,23.28 K5.COIL1 45.94,27.94 | K8.COIL1 63.72,13.55 65.41,15.24 65.41,21.59 63.72,23.28 K7.COIL1 63.72,27.94 | K10.COIL1 81.5,13.55 83.19,15.24 v83.19,17.78 83.19,21.59 81.5,23.28 K9.COIL1 81.5,25.18 78.74,27.94 63.72,27.94 | K2.COIL1 10.38,13.55 12.06,15.24 12.06,21.59 10.38,23.28 K1.COIL1 10.38,24.98 13.34,27.94 15.24,27.94 | 15.24,27.94 28.16,27.94 | 28.16,27.94 45.94,27.94 | 45.94,27.94 50.8,27.94 | 50.8,27.94 63.72,27.94 | v50.8,41.91 50.8,27.94 | X1.2 15.24,27.94
+24V_IN
  Top 0.406: J1.5 15.24,49.53 X1.1
  Top 0.813: J1.4 J1.5
BOT
  pour Bottom: 93.66,84.45 98.11,84.45 98.11,82.55 93.66,82.55
CANH
  Top 0.406: J1.7 12.7,49.53 12.7,50.8 12.06,50.8 12.06,51.44 12.7,51.44 12.7,52.07 12.06,52.07 12.06,52.7 12.7,52.7 12.7,53.98 13.34,54.61 J1.2 17.46,54.61 19.05,53.02 19.05,52.07 20.32,50.8 IC4.7
CANL
  Top 0.406: J1.1 17.14,55.88 19.68,53.34 19.68,52.7 20.32,52.07 IC4.6
  Bottom 0.406: J1.8 13.33,46.99 12.7,47.62 12.7,54.62 J1.1
CS  (via drill 0.35 pad 0.7)
  Top 0.305: IC3.16 v32.38,57.47 | v33.02,73.03 34.02,73.03
  Top 0.406: 34.02,73.03 IC2.44
  Bottom 0.305: v33.02,73.03 33.02,67.94 32.7,67.63 32.7,59.37 32.07,58.74 32.07,57.78 v32.38,57.47 32.38,53.02 31.75,52.39 30.16,52.39 R20.1
GND  (via drill 0.35 pad 0.7)
  Top 0.406: Q1.2 27.49,62.43 C4.2 | Q1.4 29.79,69.9 C3.1 | Q2.2 41.2,40.25 C6.2 | Q2.4 33.73,42.55 C5.1 | LED12.C LED11.C LED10.C LED9.C LED8.C LED7.C LED6.C LED5.C LED4.C LED3.C LED2.C LED1.C 42.01,55.66 v41.91,55.56 | IC6.8 56.52,43.81 55.88,43.18 v55.24,43.18 45.72,43.18 45.09,43.81 IC5.8 | IC2.39 38.1,75.25 C9.1 | IC7.3 IC7.2 v78.11,82.87 | IC8.1 57.78,81.6 57.15,82.23 57.15,84.14 | 57.78,84.14 IC8.3 57.15,84.14 | IC9.8 v35.88,90.49 | IC8.8 v57.47,90.49 | IC7.8 v79.06,90.49 | LED13.C v62.87,74.61 | IC9.3 36.2,84.14 34.92,85.41 v34.92,86.68 | 57.15,84.14 57.15,86.04 v56.52,86.68 | C8.2 v26.04,55.56 C7.2 | IC4.2 25.08,50.8 v24.45,50.16 23.81,49.53 IC4.8 | S1.2 17.62,74.61 v21.59,74.61 25.56,74.61 S1.1
  other vias: 24.13,46.67 24.13,37.78 24.13,42.23 27.62,71.75 27.62,39.05 27.62,45.09 25.4,37.78 25.4,46.67 39.37,67.94 41.27,44.45 36.83,71.75 38.73,63.5 26.67,46.04 26.67,38.1 35.88,66.67 41.91,67.94
  pour Top: 31.75,38.1 43.18,38.1 43.18,45.72 39.37,45.72 37.47,43.81 31.75,43.81
  pour Top: 24.77,72.39 43.18,72.39 43.18,60.96 33.02,60.96 32.38,60.33 24.77,60.33
  pour Bottom: -1.27,101.6 101.6,101.6 101.6,81.28 77.47,81.28 arc90 67.31,71.12 67.31,35.56 -1.27,35.56
  pour Top: 19.05,48.26 26.67,48.26 29.21,45.72 29.21,38.1 26.67,35.56 19.05,35.56
IN1
  Top 0.406: IC7.4 82.23,85.41 83.82,87 83.82,93.03 85.09,94.3 X8.1
IN2
  Top 0.406: IC7.5 82.23,86.68 83.19,87.63 83.19,93.66 82.55,94.3 X8.2
IN3
  Top 0.406: IC7.6 82.23,87.95 82.55,88.27 82.55,91.76 80.01,94.3 X8.3
IN4
  Top 0.406: IC7.7 78.42,89.22 77.47,90.17 X8.4
IN5
  Top 0.406: IC7.9 73.98,90.49 74.93,91.44 X8.5
IN6
  Top 0.406: IC7.10 70.17,89.22 69.85,89.53 69.85,91.76 72.39,94.3 X8.6
IN7
  Top 0.406: IC7.11 70.17,87.95 69.22,88.9 69.22,93.66 69.85,94.3 X8.7
IN8
  Top 0.406: IC7.12 70.17,86.68 68.58,88.27 68.58,93.03 67.31,94.3 X8.8
IN9
  Top 0.406: IC8.4 60.64,85.41 62.23,87 62.23,93.03 63.5,94.3 X9.1
IN10
  Top 0.406: IC8.5 60.64,86.68 61.59,87.63 61.59,93.66 60.96,94.3 X9.2
IN11
  Top 0.406: IC8.6 60.64,87.95 60.96,88.27 60.96,91.76 58.42,94.3 X9.3
IN12
  Top 0.406: IC8.7 56.83,89.22 55.88,90.17 X9.4
IN13
  Top 0.406: IC8.9 52.39,90.49 53.34,91.44 X9.5
IN14
  Top 0.406: IC8.10 48.58,89.22 48.26,89.53 48.26,91.76 50.8,94.3 X9.6
IN15
  Top 0.406: IC8.11 48.58,87.95 47.62,88.9 47.62,93.66 48.26,94.3 X9.7
IN16
  Top 0.406: IC8.12 48.58,86.68 46.99,88.27 46.99,93.03 45.72,94.3 X9.8
IN17
  Top 0.406: IC9.4 39.05,85.41 40.64,87 40.64,93.03 41.91,94.3 X10.1
IN18
  Top 0.406: IC9.5 39.05,86.68 40.01,87.63 40.01,93.66 39.37,94.3 X10.2
IN19
  Top 0.406: IC9.6 39.05,87.95 39.37,88.27 39.37,91.76 36.83,94.3 X10.3
IN20
  Top 0.406: IC9.7 35.24,89.22 34.29,90.17 X10.4
IN21
  Top 0.406: IC9.9 30.8,90.49 31.75,91.44 X10.5
IN22
  Top 0.406: IC9.10 26.99,89.22 26.67,89.53 26.67,91.76 29.21,94.3 X10.6
IN23
  Top 0.406: IC9.11 26.99,87.95 26.04,88.9 26.04,93.66 26.67,94.3 X10.7
IN24
  Top 0.406: IC9.12 26.99,86.68 25.4,88.27 25.4,93.03 24.13,94.3 X10.8
INT_MCP  (via drill 0.35 pad 0.7)
  Top 0.305: IC3.12 37.47,53.98 36.83,53.34 v31.43,53.34 | v31.75,62.23 31.75,63.31 IC2.11
  Bottom 0.305: v31.43,53.34 31.43,54.93 | 31.43,54.93 31.43,59.05 31.75,59.37 v31.75,62.23 | R21.1 31.43,54.93
INT_PCF  (via drill 0.35 pad 0.7)
  Top 0.406: IC7.13 v69.22,85.41 | IC8.13 v47.62,85.41 | IC9.13 v26.04,85.41 | IC2.12 34.1,63.31 35.56,64.77 v36.83,64.77 | v40.96,85.41 v40.96,76.2 R4.1
  Bottom 0.406: v69.22,85.41 v47.62,85.41 v40.96,85.41 v26.04,85.41 | v36.83,64.77 38.73,64.77 40.96,66.99 v40.96,76.2
LED_LIGHT_1  (via drill 0.35 pad 0.7)
  Top 0.406: IC6.14 v62.87,40.96
  Bottom 0.406: v62.87,40.96 68.9,34.92 92.71,34.92 95.25,32.38 95.25,10.79 92.08,7.62 85.41,7.62 83.82,6.03 X4.2
LED_LIGHT_2  (via drill 0.35 pad 0.7)
  Top 0.406: IC6.13 v61.59,40.96 | X5.2 90.17,6.99 v92.08,8.89
  Bottom 0.406: v61.59,40.96 68.26,34.29 92.39,34.29 94.61,32.07 94.61,11.43 v92.08,8.89
MISO  (via drill 0.35 pad 0.7)
  Top 0.305: v34.92,69.85 34.27,70.51 IC2.2 | IC3.15 v33.66,57.47
  Bottom 0.305: v33.66,57.47 33.97,57.78 33.97,66.99 34.92,67.94 v34.92,69.85 34.92,72.39 30.8,76.52 29.84,76.52 29.21,75.88 ISP.MISO
MOSI  (via drill 0.35 pad 0.7)
  Top 0.305: IC3.14 v34.92,57.47 | v35.88,70.17 34.73,71.31 IC2.1 | ISP.MOSI 31.11,74.3 31.75,73.66 31.75,71.44 31.88,71.31
  Top 0.406: 31.88,71.31 IC2.1
  Bottom 0.305: v34.92,57.47 34.61,57.78 34.61,66.67 35.88,67.94 v35.88,70.17
MV_1
  Top 0.813: K1.CON1DEFAULT 7.84,31.33 5.71,29.21 5.71,10.79 11.43,5.08 X2.1
MV_2
  Top 0.813: K2.CON1DEFAULT 7.84,18.2 9.53,16.51 10.79,16.51 19.68,7.62 22.86,7.62 24.13,6.35 X2.2
MV_3
  Top 0.813: K3.CON1DEFAULT 25.62,31.33 23.5,29.21 23.5,9.53 26.67,6.35 X2.3
MV_4
  Top 0.813: K4.CON1DEFAULT 25.62,18.2 27.3,16.51 28.57,16.51 30.48,14.61 30.48,10.16 29.21,8.89 X2.4
MV_5
  Top 0.813: K5.CON1DEFAULT 43.4,31.33 41.27,29.21 41.27,12.06 38.1,8.89 35.24,8.89 31.75,5.4 X2.5
MV_6
  Top 0.813: K6.CON1DEFAULT 43.4,18.2 45.09,16.51 46.35,16.51 50.16,12.7 X3.1
MV_7
  Top 0.813: K7.CON1DEFAULT 61.18,31.33 59.05,29.21 59.05,12.06 55.88,8.89 55.56,8.89 52.7,6.03 X3.2
MV_8
  Top 0.813: K8.CON1DEFAULT 61.18,18.2 62.87,16.51 64.14,16.51 66.04,14.61 66.04,10.79 65.09,10.16 59.37,10.16 55.24,6.03 X3.3
MV_9
  Top 0.813: K9.CON1DEFAULT 78.96,31.33 76.83,29.21 76.83,12.06 73.34,8.89 60.33,8.89 57.78,6.35 X3.4
MV_10
  Top 0.813: K10.CON1DEFAULT 78.96,18.2 80.64,16.51 81.92,16.51 83.82,14.61 83.82,10.79 82.55,9.53 76.83,9.53 74.93,7.62 61.59,7.62 60.33,6.35 X3.5
MV_COM
  Top 0.813: K5.CENTER1 K5.CENTER2 | K3.CENTER2 K3.CENTER1 | K1.CENTER2 K1.CENTER1 | K7.CENTER2 K7.CENTER1 | K9.CENTER2 K9.CENTER1
  Bottom 0.813: K5.CENTER1 K6.CENTER2 K6.CENTER1 | K4.CENTER1 K4.CENTER2 K3.CENTER1 | K1.CENTER1 K2.CENTER2 K2.CENTER1 | K7.CENTER1 K8.CENTER2 K8.CENTER1 | K9.CENTER1 K10.CENTER2 K10.CENTER1
  Bottom 1.016: K4.CENTER1 38.32,10.16 | K10.CENTER1 89.18,10.16 73.88,10.16 | 38.32,10.16 23.01,10.16 K2.CENTER1 | K8.CENTER1 73.88,10.16 | 38.32,10.16 56.1,10.16 | 56.1,10.16 K6.CENTER1 | 73.88,10.16 62.87,10.16 | 62.87,10.16 56.1,10.16 | X3.6 62.87,10.16
N$1
  Top 0.406: R2.1 31.11,59.05 IC3.17
N$2
  Top 0.406: IC2.36 40.5,74.16 41.27,74.93 43.18,74.93 43.5,74.61 R3.1
N$10
  Top 0.406: R3.2 LED13.A
N$11
  Top 2.184: X6.3 K11.12
  Bottom 2.184: X6.3 K11.12
N$12
  Top 2.184: X6.1 K11.14
  Bottom 2.184: X6.1 K11.14
N$13
  Top 2.184: X7.3 K12.12
  Bottom 2.184: X7.3 K12.12
N$14
  Top 2.184: X7.1 K12.14
  Bottom 2.184: X7.1 K12.14
N$17
  Top 2.184: X6.2 K11.11
  Bottom 2.184: X6.2 K11.11
N$18
  Top 2.184: X7.2 K12.11
  Bottom 2.184: X7.2 K12.11
N$22
  Top 0.406: LED1.A R8.2
N$23
  Top 0.406: LED2.A R9.2
N$24
  Top 0.406: LED3.A R10.2
N$25
  Top 0.406: LED4.A R11.2
N$32
  Top 0.406: LED5.A R12.2
N$33
  Top 0.406: LED6.A R13.2
N$34
  Top 0.406: LED7.A R14.2
N$35
  Top 0.406: LED8.A R15.2
N$36
  Top 0.406: LED9.A R16.2
N$37
  Top 0.406: LED10.A R17.2
N$38
  Top 0.406: LED12.A R19.2
N$39
  Top 0.406: LED11.A R18.2
OUT1  (via drill 0.35 pad 0.7)
  Top 0.406: IC5.7 v46.35,46.67 45.09,47.94 44.13,47.94 43.5,48.58 R8.1 | IC2.15 36.5,60.34 38.42,58.42 45.09,58.42 v46.35,57.15
  Bottom 0.406: v46.35,57.15 v46.35,46.67
OUT2  (via drill 0.35 pad 0.7)
  Top 0.406: IC5.6 v47.62,46.67 46.35,47.94 46.04,47.94 45.4,48.58 R9.1 | IC2.16 37.3,60.49 38.73,59.05 45.72,59.05 v47.62,57.15
  Bottom 0.406: v47.62,57.15 v47.62,46.67
OUT3  (via drill 0.35 pad 0.7)
  Top 0.406: IC5.5 v48.9,46.67 47.31,48.26 R10.1 | IC2.21 41.3,60.3 41.91,59.69 46.35,59.69 v48.9,57.15
  Bottom 0.406: v48.9,57.15 v48.9,46.67
OUT4  (via drill 0.35 pad 0.7)
  Top 0.406: IC5.4 v50.16,46.67 49.21,47.62 R11.1 | IC2.22 45.8,61.51 v50.16,57.15
  Bottom 0.406: v50.16,57.15 v50.16,46.67
OUT5  (via drill 0.35 pad 0.7)
  Top 0.406: IC5.3 v51.44,46.67 51.12,46.99 R12.1 | IC2.23 45.27,63.31 v51.44,57.15
  Bottom 0.406: v51.44,57.15 v51.44,46.67
OUT6  (via drill 0.35 pad 0.7)
  Top 0.406: IC5.2 v52.7,46.67 53.02,46.99 R13.1 | IC2.24 45.74,64.11 v52.7,57.15
  Bottom 0.406: v52.7,57.15 v52.7,46.67
OUT7  (via drill 0.35 pad 0.7)
  Top 0.406: IC5.1 v53.98,46.67 54.93,47.62 R14.1 | IC2.25 46.22,64.91 v53.98,57.15
  Bottom 0.406: v53.98,57.15 v53.98,46.67
OUT8  (via drill 0.35 pad 0.7)
  Top 0.406: IC6.7 v57.78,46.67 56.83,47.62 R15.1 | IC2.26 49.23,65.71 v57.78,57.15
  Bottom 0.406: v57.78,57.15 v57.78,46.67
OUT9  (via drill 0.35 pad 0.7)
  Top 0.406: IC6.6 v59.05,46.67 58.74,46.99 R16.1 | IC2.30 47.3,68.91 v59.05,57.15
  Bottom 0.406: v59.05,57.15 v59.05,46.67
OUT10  (via drill 0.35 pad 0.7)
  Top 0.406: IC6.5 v60.33,46.67 60.64,46.99 R17.1 | IC2.31 47.77,69.71 v60.33,57.15
  Bottom 0.406: v60.33,57.15 v60.33,46.67
OUT11  (via drill 0.35 pad 0.7)
  Top 0.406: IC6.2 v64.14,46.67 62.55,48.26 R18.1 | IC2.32 50.77,70.51 v64.14,57.15
  Bottom 0.406: v64.14,57.15 v64.14,46.67
OUT12  (via drill 0.35 pad 0.7)
  Top 0.406: IC6.1 v65.41,46.67 64.45,47.62 R19.1 | IC2.33 51.24,71.31 v65.41,57.15
  Bottom 0.406: v65.41,57.15 v65.41,46.67
OUT_LED_1  (via drill 0.35 pad 0.7)
  Top 0.406: IC6.3 v62.87,46.67 | v62.87,60.96 50.8,73.03 42.19,73.03 IC2.34
  Bottom 0.406: v62.87,46.67 v62.87,60.96
OUT_LED_2  (via drill 0.35 pad 0.7)
  Top 0.406: IC6.4 v61.59,46.67 | v61.59,63.5 51.44,73.66 43.18,73.66 42.55,74.3 41.59,74.3 41.27,73.98 41.27,73.14 IC2.35
  Bottom 0.406: v61.59,46.67 v61.59,63.5
RELAIS_1
  Top 0.406: K1.COIL2 10.98,32.38 14.61,32.38 17.14,34.92 32.38,34.92 33.66,36.2 45.09,36.2 46.35,37.47 IC5.10
RELAIS_2
  Top 0.406: IC5.11 47.62,37.47 45.72,35.56 34.29,35.56 33.02,34.29 17.78,34.29 12.7,29.21 12.7,22.86 10.38,20.54 K2.COIL2
RELAIS_3
  Top 0.406: IC5.12 48.9,37.47 46.35,34.92 34.92,34.92 32.38,32.38 28.76,32.38 K3.COIL2
RELAIS_4
  Top 0.406: IC5.13 50.16,37.47 46.99,34.29 35.56,34.29 30.48,29.21 30.48,22.86 28.16,20.54 K4.COIL2
RELAIS_5
  Top 0.406: IC5.14 51.44,37.47 45.94,31.97 K5.COIL2
RELAIS_6
  Top 0.406: K6.COIL2 45.94,20.54 48.26,22.86 48.26,33.02 52.7,37.47 IC5.15
RELAIS_7
  Top 0.406: K7.COIL2 63.72,33.44 62.87,34.29 57.15,34.29 53.98,37.47 IC5.16
RELAIS_8
  Top 0.406: K8.COIL2 63.72,20.54 66.04,22.86 66.04,33.02 64.14,34.92 60.33,34.92 57.78,37.47 IC6.10
RELAIS_9
  Top 0.406: K9.COIL2 81.5,34.07 80.01,35.56 60.96,35.56 59.05,37.47 IC6.11
RELAIS_10
  Top 0.406: K10.COIL2 81.5,20.54 83.82,22.86 83.82,33.02 80.64,36.2 61.59,36.2 60.33,37.47 IC6.12
RELAIS_11
  Top 0.406: IC6.15 64.14,37.47 64.77,36.83 68.21,36.83 K11.A1
RELAIS_12  (via drill 0.35 pad 0.7)
  Top 0.406: IC6.16 65.41,40.01 67.31,41.91 v67.31,54.61 | K12.A1 72.11,61.31 v67.31,56.52
  Bottom 0.406: v67.31,56.52 v67.31,54.61
RST  (via drill 0.35 pad 0.7)
  Top 0.305: IC2.4 35.89,68.91 36.83,69.85 36.83,70.48 v35.88,71.44
  Top 0.406: R1.1 31.75,77.15 v29.21,77.15 27.28,79.08 S1.3 S1.4
  Bottom 0.305: ISP.RST 28.57,73.03 28.26,73.34 28.26,76.2 v29.21,77.15 31.11,77.15 35.88,72.39 v35.88,71.44
RXCAN
  Top 0.406: IC4.4 28.89,53.34 31.11,51.12 IC3.2
SCK  (via drill 0.35 pad 0.7)
  Top 0.305: v33.97,69.69 33.8,69.71 IC2.3 31.25,69.71 31.11,69.85 31.11,71.44 30.48,72.07 28.89,72.07 28.26,72.71 28.26,73.98 28.57,74.3 ISP.SCK | IC3.13 36.2,57.47 35.24,58.42 v33.02,58.42
  Bottom 0.305: v33.02,58.42 33.34,58.74 33.34,67.31 33.97,67.94 v33.97,69.69
SCL  (via drill 0.35 pad 0.7)
  Top 0.406: IC7.14 v69.22,84.14 | IC8.14 v47.62,84.14 | IC9.14 v26.04,84.14 7.62,84.14 6.03,82.55 X12.4 | IC2.19 39.7,63.17 v40.01,63.5 | v42.86,84.14 v42.86,78.11 R6.1
  Bottom 0.406: v69.22,84.14 v47.62,84.14 v42.86,84.14 v26.04,84.14 | v40.01,63.5 42.86,66.36 v42.86,78.11
SDA  (via drill 0.35 pad 0.7)
  Top 0.406: IC7.15 v69.22,82.87 | IC8.15 v47.62,82.87 | IC9.15 v26.04,82.87 | IC2.20 40.5,62.73 v41.27,63.5 | v44.13,82.87 v44.13,80.01 R5.1 | v23.81,85.09 X12.3
  Bottom 0.406: v69.22,82.87 v47.62,82.87 v44.13,82.87 v26.04,82.87 v23.81,85.09 | v41.27,63.5 44.13,66.36 v44.13,80.01
TOP
  pour Top: 93.66,84.45 98.11,84.45 98.11,82.55 93.66,82.55
TXCAN
  Top 0.406: IC4.1 28.89,49.53 29.84,48.58 IC3.1
XTAL1
  Top 0.406: C3.2 27.49,69.9 Q1.1 27.62,67.88 27.62,67.44 28.55,66.51 IC2.7
XTAL2
  Top 0.406: C4.1 29.79,62.43 Q1.3 29.78,65.53 29.96,65.71 IC2.8
XTAL3
  Top 0.406: C5.2 33.73,40.25 Q2.1 36.44,40.57 37.47,41.59 IC3.7
XTAL4
  Top 0.406: C6.1 41.2,42.55 Q2.3 39.31,42.55 38.73,42.55 IC3.8

### Text on the board
tPlace: CAN-Bus / Gartensteuerung / / Rev 2021/01 / (c) Peter Müller
tNames: GND | IN 24..17 | IN 16..9 | IN 8..1 | IN 1..24 / 5V TTL | I²C | Out 11..12 / Max. 230V / 10A (AC) | 1-Wire | Reset | 1-Wire | Out 11..12 | CAN-Bus | ON | Out 1..10 / Max. 50V / 1A / (AC / DC) | Out 13..14 / 24V DC / Max. 0,1A | Out 1..5 | Out 6..10 | C | OUT 13..14
tRestrict: TOP
bRestrict: BOT